# EAGLE schematic equalizer schematic (EAGLE 8.3.1)
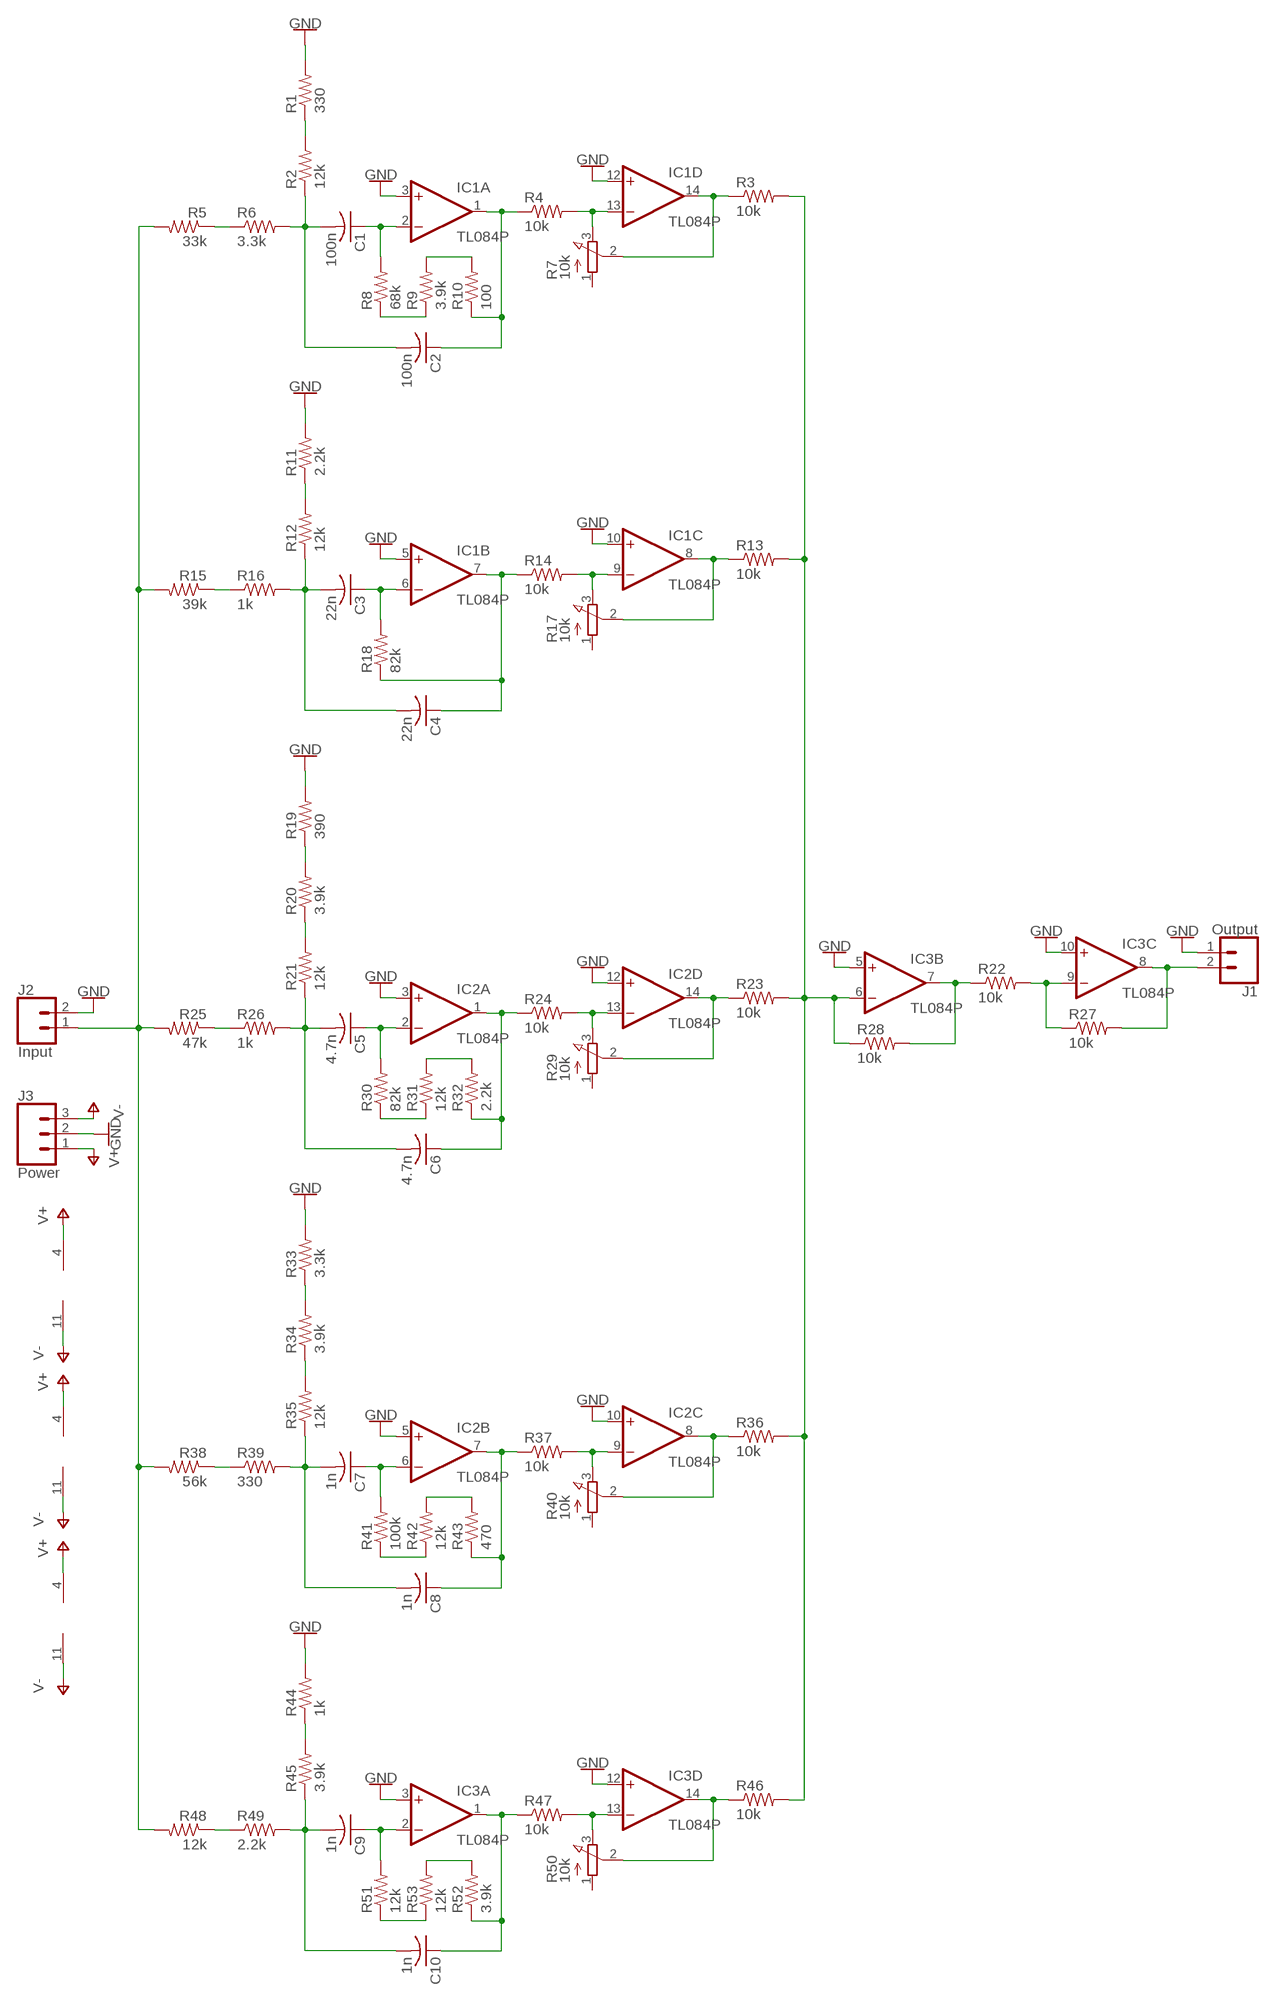
[diagram p0: schematic, sheet 1]

## Parts
C1  100n  C-US075-032X103  [C075-032X103]
C2  100n  C-US075-032X103  [C075-032X103]
C3  22n  C-US075-032X103  [C075-032X103]
C4  22n  C-US075-032X103  [C075-032X103]
C5  4.7n  C-US050-024X044  [C050-024X044]
C6  4.7n  C-US050-024X044  [C050-024X044]
C7  1n  C-US050-024X044  [C050-024X044]
C8  1n  C-US050-024X044  [C050-024X044]
C9  1n  C-US050-024X044  [C050-024X044]
C10  1n  C-US050-024X044  [C050-024X044]
IC1  TL084P  [DIL14]
IC2  TL084P  [DIL14]
IC3  TL084P  [DIL14]
J1  Output  CONN_025MM  [SCREWTERMINAL-5MM-2]
J2  Input  CONN_025MM  [SCREWTERMINAL-5MM-2]
J3  Power  CONN_03-SCREW-5MM  [SCREWTERMINAL-5MM-3]
R1  330  R-US_0207/7  [0207/7]
R2  12k  R-US_0207/7  [0207/7]
R3  10k  R-US_0207/7  [0207/7]
R4  10k  R-US_0207/7  [0207/7]
R5  33k  R-US_0207/7  [0207/7]
R6  3.3k  R-US_0207/7  [0207/7]
R7  10k  3RP/1610N  [3RP/1610N]
R8  68k  R-US_0207/7  [0207/7]
R9  3.9k  R-US_0207/7  [0207/7]
R10  100  R-US_0207/7  [0207/7]
R11  2.2k  R-US_0207/7  [0207/7]
R12  12k  R-US_0207/7  [0207/7]
R13  10k  R-US_0207/7  [0207/7]
R14  10k  R-US_0207/7  [0207/7]
R15  39k  R-US_0207/7  [0207/7]
R16  1k  R-US_0207/7  [0207/7]
R17  10k  3RP/1610N  [3RP/1610N]
R18  82k  R-US_0207/7  [0207/7]
R19  390  R-US_0207/7  [0207/7]
R20  3.9k  R-US_0207/7  [0207/7]
R21  12k  R-US_0207/7  [0207/7]
R22  10k  R-US_0207/7  [0207/7]
R23  10k  R-US_0207/7  [0207/7]
R24  10k  R-US_0207/7  [0207/7]
R25  47k  R-US_0207/7  [0207/7]
R26  1k  R-US_0207/7  [0207/7]
R27  10k  R-US_0207/7  [0207/7]
R28  10k  R-US_0207/7  [0207/7]
R29  10k  3RP/1610N  [3RP/1610N]
R30  82k  R-US_0207/7  [0207/7]
R31  12k  R-US_0207/7  [0207/7]
R32  2.2k  R-US_0207/7  [0207/7]
R33  3.3k  R-US_0207/7  [0207/7]
R34  3.9k  R-US_0207/7  [0207/7]
R35  12k  R-US_0207/7  [0207/7]
R36  10k  R-US_0207/7  [0207/7]
R37  10k  R-US_0207/7  [0207/7]
R38  56k  R-US_0207/7  [0207/7]
R39  330  R-US_0207/7  [0207/7]
R40  10k  3RP/1610N  [3RP/1610N]
R41  100k  R-US_0207/7  [0207/7]
R42  12k  R-US_0207/7  [0207/7]
R43  470  R-US_0207/7  [0207/7]
R44  1k  R-US_0207/7  [0207/7]
R45  3.9k  R-US_0207/7  [0207/7]
R46  10k  R-US_0207/7  [0207/7]
R47  10k  R-US_0207/7  [0207/7]
R48  12k  R-US_0207/7  [0207/7]
R49  2.2k  R-US_0207/7  [0207/7]
R50  10k  3RP/1610N  [3RP/1610N]
R51  12k  R-US_0207/7  [0207/7]
R52  3.9k  R-US_0207/7  [0207/7]
R53  12k  R-US_0207/7  [0207/7]

## Nets
GND: IC1.3(A:+IN) IC1.5(B:+IN) IC1.10(C:+IN) IC1.12(D:+IN) IC2.3(A:+IN) IC2.5(B:+IN) IC2.10(C:+IN) IC2.12(D:+IN) IC3.3(A:+IN) IC3.5(B:+IN) IC3.10(C:+IN) IC3.12(D:+IN) J1.1 J2.2 J3.2 R1.2 R11.2 R19.2 R33.2 R44.2
N$1: C1.1 IC1.2(A:-IN) R8.2
N$2: C1.2 C2.2 R2.1 R6.2
N$3: C2.1 IC1.1(A:OUT) R4.1 R10.1
N$4: IC1.13(D:-IN) R4.2 R7.3(E)
N$5: IC1.14(D:OUT) R3.1 R7.2(S)
N$6: C3.1 IC1.6(B:-IN) R18.2
N$7: C3.2 C4.2 R12.1 R16.2
N$8: C4.1 IC1.7(B:OUT) R14.1 R18.1
N$9: IC1.9(C:-IN) R14.2 R17.3(E)
N$10: IC1.8(C:OUT) R13.1 R17.2(S)
N$11: R15.1 R16.1
N$12: R11.1 R12.2
N$13: R19.1 R20.2
N$14: IC2.13(D:-IN) R24.2 R29.3(E)
N$15: IC2.14(D:OUT) R23.1 R29.2(S)
N$16: C7.1 IC2.6(B:-IN) R41.2
N$17: C5.1 IC2.2(A:-IN) R30.2
N$18: C5.2 C6.2 R21.1 R26.2
N$19: IC2.9(C:-IN) R37.2 R40.3(E)
N$20: IC2.8(C:OUT) R36.1 R40.2(S)
N$21: C6.1 IC2.1(A:OUT) R24.1 R32.1
N$22: R25.1 R26.1
N$23: R20.1 R21.2
N$24: IC3.13(D:-IN) R47.2 R50.3(E)
N$25: IC3.14(D:OUT) R46.1 R50.2(S)
N$26: IC3.6(B:-IN) R3.2 R13.2 R23.2 R28.1 R36.2 R46.2
N$27: IC3.9(C:-IN) R22.2 R27.1
N$28: IC3.7(B:OUT) R22.1 R28.2
N$29: IC3.8(C:OUT) J1.2 R27.2
N$30: R9.2 R10.2
N$31: R5.1 R6.1
N$32: R1.1 R2.2
N$33: R8.1 R9.1
N$34: R31.2 R32.2
N$35: R30.1 R31.1
N$36: C7.2 C8.2 R35.1 R39.2
N$37: C8.1 IC2.7(B:OUT) R37.1 R43.1
N$38: R38.1 R39.1
N$39: R34.1 R35.2
N$40: R42.2 R43.2
N$41: R41.1 R42.1
N$42: R33.1 R34.2
N$43: C9.1 IC3.2(A:-IN) R51.2
N$44: C9.2 C10.2 R45.1 R49.2
N$45: C10.1 IC3.1(A:OUT) R47.1 R52.1
N$46: R48.1 R49.1
N$47: R44.1 R45.2
N$48: R51.1 R53.1
N$49: J2.1 R5.2 R15.2 R25.2 R38.2 R48.2
N$50: R52.2 R53.2
V+: IC1.4(P:V+) IC2.4(P:V+) IC3.4(P:V+) J3.1
V-: IC1.11(P:V-) IC2.11(P:V-) IC3.11(P:V-) J3.3
Unconnected: R7.1(A) R17.1(A) R29.1(A) R40.1(A) R50.1(A)

## Library data of the parts
C1-C10 = adafruit:C-US: CAPACITOR, American symbol
IC1-IC3 = linear:TL084: OP AMP
J1 J2 = SparkFun-Connectors:CONN_02: Multi connection point. Often used as Generic Header-pin footprint for 0.1 inch spaced/style header connections On any of the 0.1 inch spaced packages, you can populate with these: Break Away Headers - Straight <https://www.sparkfun.com/products/116> (PRT-00116) Break Away Male Headers - Right Angle <https://www.sparkfun.com/products/553> (PRT-00553) Female Headers <https://www.sparkfun.com/products/115> (PRT-00115) Break Away Headers - Machine Pin <https://www.sparkfun.com/products/117> (PRT-00117) Break Away Female Headers - Swiss Machine Pin <https://www.sparkfun.com/products/743> (PRT-00743) For SCREWTERMINALS and SPRING TERMINALS visit here: Screw Terimnals on SparkFun.com <https://www.sparkfun.com/search/results?term=Screw+Terminals> (5mm/3.5mm/2.54mm spacing) This device is also useful as a general connection point to wire up your design to another part of your project. Our various solder wires solder well into these plated through hole pads. Hook-Up Wire - Assortment (Stranded, 22 AWG) <https://www.sparkfun.com/products/11375> (PRT-11375) Hook-Up Wire - Assortment (Solid Core, 22 AWG) <https://www.sparkfun.com/products/11367> (PRT-11367) View the entire wire category on our website here <https://www.sparkfun.com/categories/141> Special notes: Molex polarized connector foot print use with: PRT-08233 with associated crimp pins and housings. 2.54_SCREWTERM for use with PRT-10571. 3.5mm Screw Terminal footprints for PRT-08084 5mm Screw Terminal footprints for use with PRT-08432; SF_SKU: PRT-08432
J3 = SparkFun-Connectors:CONN_03: Multi connection point. Often used as Generic Header-pin footprint for 0.1 inch spaced/style header connections On any of the 0.1 inch spaced packages, you can populate with these: Break Away Headers - Straight <https://www.sparkfun.com/products/116> (PRT-00116) Break Away Male Headers - Right Angle <https://www.sparkfun.com/products/553> (PRT-00553) Female Headers <https://www.sparkfun.com/products/115> (PRT-00115) Break Away Headers - Machine Pin <https://www.sparkfun.com/products/117> (PRT-00117) Break Away Female Headers - Swiss Machine Pin <https://www.sparkfun.com/products/743> (PRT-00743) Stackable Header - 3 Pin (Female, 0.1") <https://www.sparkfun.com/products/13875> (PRT-13875) For SCREWTERMINALS and SPRING TERMINALS visit here: Screw Terimnals on SparkFun.com <https://www.sparkfun.com/search/results?term=Screw+Terminals> (5mm/3.5mm/2.54mm spacing) This device is also useful as a general connection point to wire up your design to another part of your project. Our various solder wires solder well into these plated through hole pads. Hook-Up Wire - Assortment (Stranded, 22 AWG) <https://www.sparkfun.com/products/11375> (PRT-11375) Hook-Up Wire - Assortment (Solid Core, 22 AWG) <https://www.sparkfun.com/products/11367> (PRT-11367) View the entire wire category on our website here <https://www.sparkfun.com/categories/141> Special notes: Molex polarized connector foot print use with SKU : PRT-08232 with associated crimp pins and housings.; PROD_ID: CONN-10134; SF_SKU: PRT-08433
R1-R6 R8-R16 R18-R28 R30-R39 R41-R49 R51-R53 = adafruit:R-US_: RESISTOR, American symbol
R7 R17 R29 R40 R50 = pot:3RP/1610N: 16mm Potentiometer one level Source: http://www.alphapotentiometers.net/html/16mm_pot_2.html